# EAGLE design Barebones (EAGLE 9.2.0)
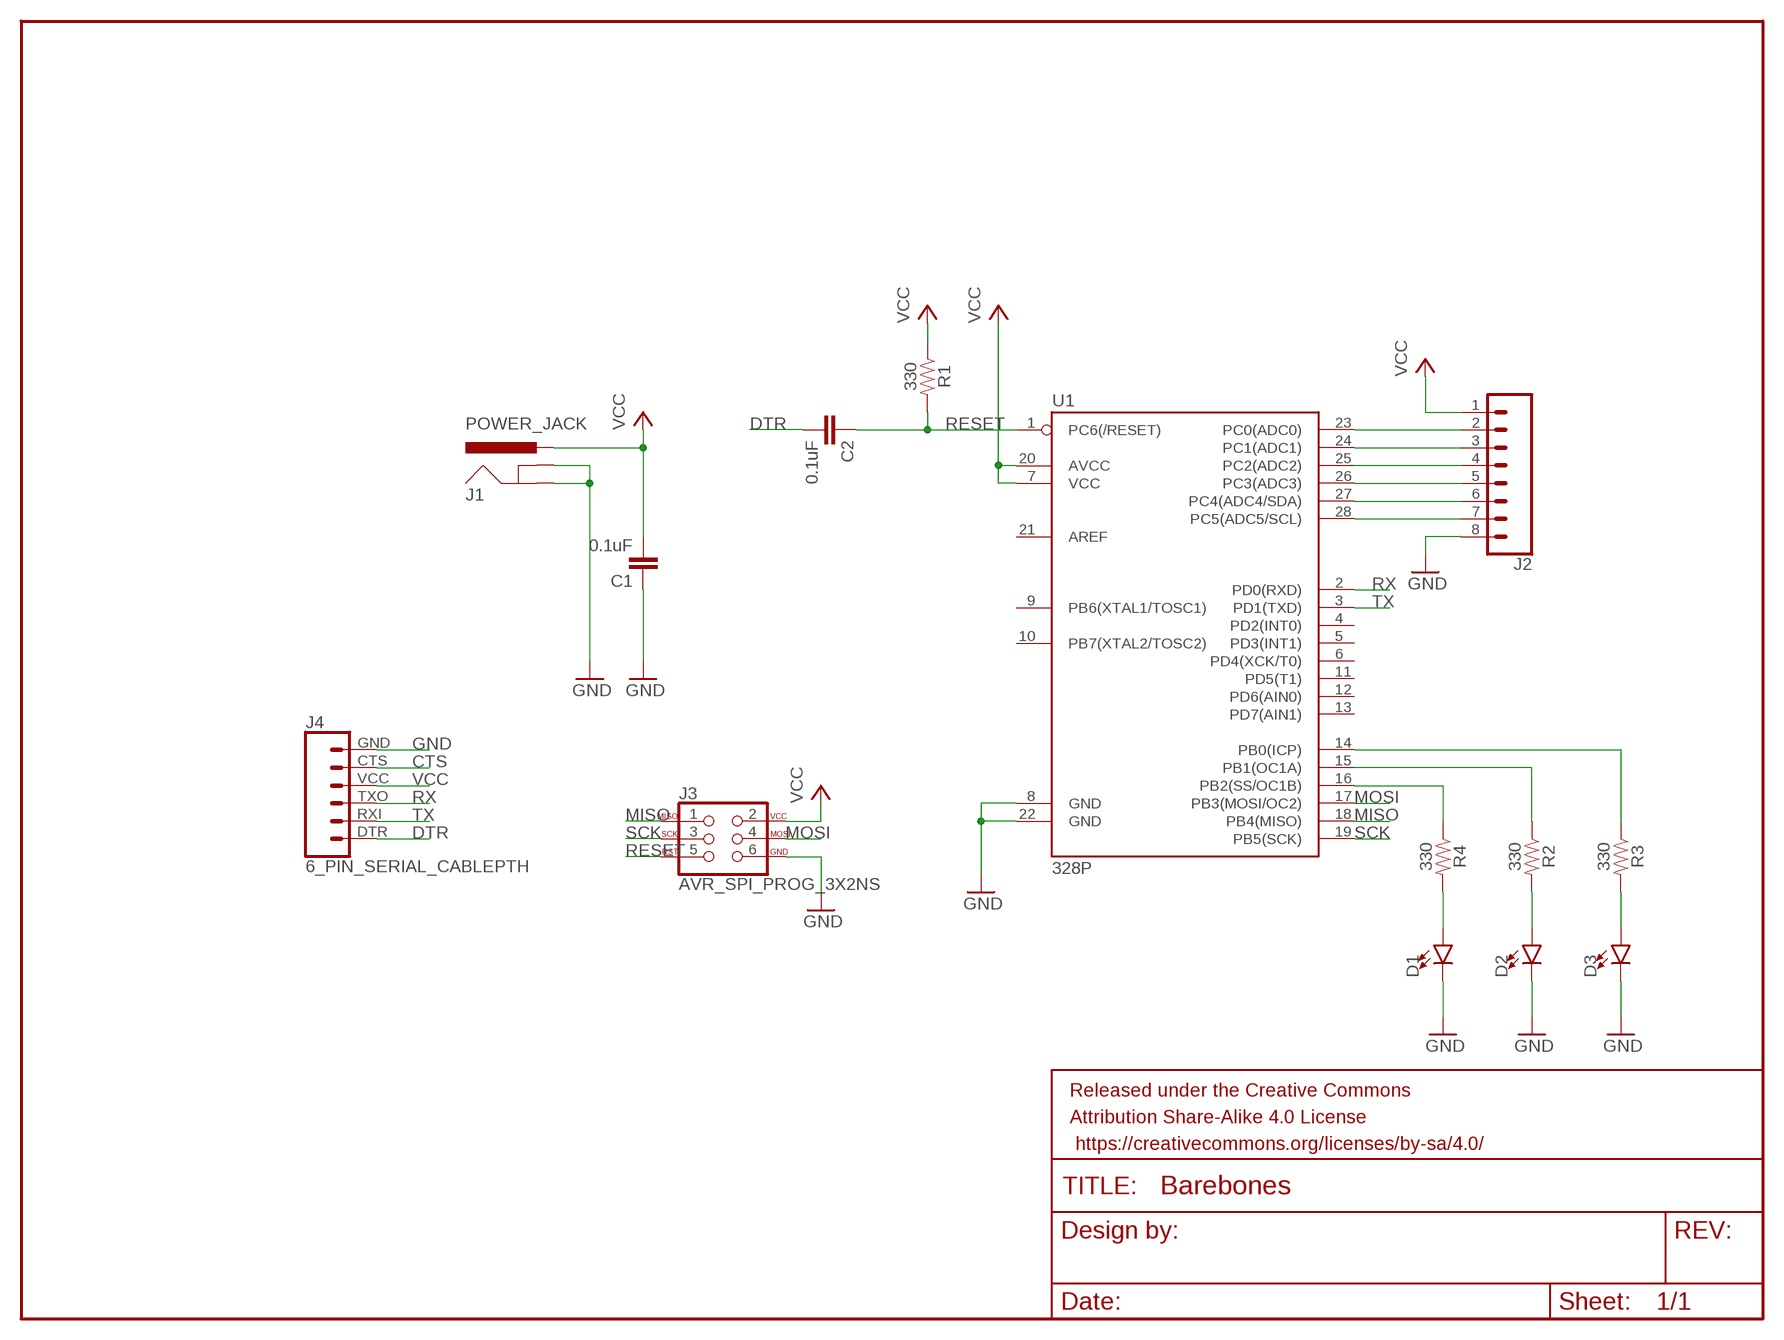
[diagram p0: schematic, sheet 1]

## Parts
C1  0.1uF  0.1UF-KIT-EZ-50V-20%  [CAP-PTH-SMALL-KIT]
C2  0.1uF  0.1UF-KIT-EZ-50V-20%  [CAP-PTH-SMALL-KIT]
D1  LED5MM  [LED_5MM]
D2  LED5MM  [LED_5MM]
D3  LED5MM  [LED_5MM]
FRAME1  FRAME-LETTER  [CREATIVE_COMMONS]
J1  POWER_JACK  [POWER_JACK_PTH]
J2  CONN_08"  [1X08]
J3  AVR_SPI_PROG_3X2NS  [2X3-NS]
J4  6_PIN_SERIAL_CABLEPTH  [FTDI_BASIC]
R1  330  330OHM-HORIZ-1/10W-5%  [AXIAL-0.3]
R2  330  330OHM-HORIZ-1/10W-5%  [AXIAL-0.3]
R3  330  330OHM-HORIZ-1/10W-5%  [AXIAL-0.3]
R4  330  330OHM-HORIZ-1/10W-5%  [AXIAL-0.3]
U1  328P  ATMEGA328P_PDIP  [DIP28]

## Nets
CTS: J4.CTS
DTR: C2.2 J4.DTR
GND: C1.1 D1.K(C) D2.K(C) D3.K(C) J1.GND J1.GNDBREAK J2.8 J3.6 J4.GND U1.8(GND) U1.22(GND)
MISO: J3.1 U1.18(PB4(MISO))
MOSI: J3.4 U1.17(PB3(MOSI/OC2))
N$1: R3.P$1 U1.14(PB0(ICP))
N$2: J2.2 U1.23(PC0(ADC0))
N$3: J2.3 U1.24(PC1(ADC1))
N$4: J2.4 U1.25(PC2(ADC2))
N$5: J2.5 U1.26(PC3(ADC3))
N$6: J2.6 U1.27(PC4(ADC4/SDA))
N$7: R2.P$1 U1.15(PB1(OC1A))
N$8: J2.7 U1.28(PC5(ADC5/SCL))
N$9: R4.P$1 U1.16(PB2(SS/OC1B))
N$11: D1.A R4.P$2
N$12: D2.A R2.P$2
N$13: D3.A R3.P$2
RESET: C2.1 J3.5 R1.P$2 U1.1(PC6(/RESET))
RX: J4.TXO U1.2(PD0(RXD))
SCK: J3.3 U1.19(PB5(SCK))
TX: J4.RXI U1.3(PD1(TXD))
VCC: C1.2 J1.PWR J2.1 J3.2 J4.VCC R1.P$1 U1.7(VCC) U1.20(AVCC)
Unconnected: U1.4(PD2(INT0)) U1.5(PD3(INT1)) U1.6(PD4(XCK/T0)) U1.9(PB6(XTAL1/TOSC1)) U1.10(PB7(XTAL2/TOSC2)) U1.11(PD5(T1)) U1.12(PD6(AIN0)) U1.13(PD7(AIN1)) U1.21(AREF)

## Library data of the parts
C1 C2 = SparkFun-Capacitors:0.1UF: 0.1µF ceramic capacitors A capacitor is a passive two-terminal electrical component used to store electrical energy temporarily in an electric field.; PROD_ID: CAP-08370
D1-D3 = SparkFun-LED:LED: LED (Generic) Standard schematic elements and footprints for 5mm, 3mm, 1206, and 0603 sized LEDs. Generic LEDs with no color specified.
FRAME1 = SparkFun-Aesthetics:FRAME-LETTER: Schematic Frame - Letter Standard 8.5x11 US Letter frame
J1 = SparkFun-Connectors:POWER_JACK: Power Jack Connector This is the standard 5.5mm barrel jack for power. The PTH is the most common, proven, reliable, footprint. The Slot footprint only works if the mill layer is transmitted to the PCB fab house so be warned. Here are the connectors we sell at SparkFun: DC Barrel Power Jack/Connector <https://www.sparkfun.com/products/119> (PRT-00119) DC Barrel Power Jack/Connector (SMD) <https://www.sparkfun.com/products/12748> (PRT-12748) DC Barrel Jack Adapter - Breadboard Compatible <https://www.sparkfun.com/products/10811> (PRT-10811) It is used on this SparkFun product (and many, many others): SparkFun RedBoard - Programmed with Arduino <https://www.sparkfun.com/products/12757> (DEV-12757) Also, if you need a mating power supply or connector, please check these out: Wall Adapter Power Supply - 9VDC 650mA <https://www.sparkfun.com/products/298> (TOL-00298) DC Barrel Jack Adapter - Male <https://www.sparkfun.com/products/10287> (PRT-10287); PROD_ID: CONN-08197
J2 = SparkFun-Connectors:CONN_08: Multi connection point. Often used as Generic Header-pin footprint for 0.1 inch spaced/style header connections On any of the 0.1 inch spaced packages, you can populate with these: Break Away Headers - Straight <https://www.sparkfun.com/products/116> (PRT-00116) Break Away Male Headers - Right Angle <https://www.sparkfun.com/products/553> (PRT-00553) Female Headers <https://www.sparkfun.com/products/115> (PRT-00115) Break Away Headers - Machine Pin <https://www.sparkfun.com/products/117> (PRT-00117) Break Away Female Headers - Swiss Machine Pin <https://www.sparkfun.com/products/743> (PRT-00743) Arduino Stackable Header - 8 Pin <https://www.sparkfun.com/products/9279> (PRT-09279) For SCREWTERMINALS and SPRING TERMINALS visit here: Screw Terimnals on SparkFun.com <https://www.sparkfun.com/search/results?term=Screw+Terminals> (5mm/3.5mm/2.54mm spacing) This device is also useful as a general connection point to wire up your design to another part of your project. Our various solder wires solder well into these plated through hole pads. Hook-Up Wire - Assortment (Stranded, 22 AWG) <https://www.sparkfun.com/products/11375> (PRT-11375) Hook-Up Wire - Assortment (Solid Core, 22 AWG) <https://www.sparkfun.com/products/11367> (PRT-11367) View the entire wire category on our website here <https://www.sparkfun.com/categories/141> Special notes: Molex polarized connector foot print use with SKU : PRT-08231 with associated crimp pins and housings. 1MM SMD Version SKU: PRT-10208 NOTES ON THE VARIANTS LOCK and LOCK_LONGPADS... This footprint was designed to help hold the alignment of a through-hole component (i.e. 6-pin header) while soldering it into place. You may notice that each hole has been shifted either up or down by 0.005 of an inch from it's more standard position (which is a perfectly straight line). This slight alteration caused the pins (the squares in the middle) to touch the edges of the holes. Because they are alternating, it causes a "brace" to hold the component in place. 0.005 has proven to be the perfect amount of "off-center" position when using our standard breakaway headers. Although looks a little odd when you look at the bare footprint, once you have a header in there, the alteration is very hard to notice. Also,if you push a header all the way into place, it is covered up entirely on the bottom side.; PROD_ID: CONN-08438
J3 = SparkFun-Connectors:AVR_SPI_PROG_3X2: AVR ISP 6 Pin This is the reduced ISP connector for AVR programming. Common on Arduino. This footprint will take up less PCB space and can be used with a 10-pin to 6-pin adapter such as SKU: BOB-08508 **Special note about "TEST_POINT" package. The stop mask is on the top side, so if you want your programming test points to be on the bottom of your board, make sure to place this package on the bottom side of the board. This also ensure that the orientation to program from the bottom side will be correct. SparkFun Products: SparkFun ISP Pogo Adapter <https://www.sparkfun.com/products/11591> - NS Tiny AVR Programmer <https://www.sparkfun.com/products/11801> -PTH
J4 = SparkFun-Connectors:6_PIN_SERIAL_CABLE: 6-pin header connection for use with the "FTDI BASIC" pinout - CABLE SIDE. Also known as "Arduino Serial Program Header". This is used on a design to provide a 6-pin connection point for serial communication usually from a USB cable (D+/D-) to these headers (RX/TX). It also has the remaining pins necessary for programming in the Arduino evironment (DTR, GND, and sometimes VCC). Note, this device has "CABLE" in the name. It is intended to be used on a design that usually lives on the end of your USB cable and prvides the converter chip (FTDI232 or FTDI231x) to commnicate serial RX/TX. The "sister" device, named "TARGET" is inteneded to be used on a design that contains a target micro-controller that you wish to program. You can populate with some of these: Female Headers <https://www.sparkfun.com/products/115> (PRT-00115) For reference (or to suit your programming needs) check out these designs: SparkFun FTDI Basic Breakout - 5V <https://www.sparkfun.com/products/9716> (DEV-09716) SparkFun FTDI Basic Breakout - 3.3V <https://www.sparkfun.com/products/9873> (DEV-09873) SparkFun FTDI SmartBasic <https://www.sparkfun.com/products/12935> (DEV-12935) SparkFun Beefy 3 - FTDI Basic Breakout <https://www.sparkfun.com/products/13746> (DEV-13746)
R1-R4 = SparkFun-Resistors:330OHM: 330Ω resistor A resistor is a passive two-terminal electrical component that implements electrical resistance as a circuit element. Resistors act to reduce current flow, and, at the same time, act to lower voltage levels within circuits. - Wikipedia; PROD_ID: RES-8371
U1 = SparkFun-IC-Microcontroller:ATMEGA328P_PDIP: Atmel 328P Through hole ATMEGA328P uC used in the Arduino 32kb flash, 1k EEPROM, 2k SRAM Datasheet <http://www.sparkfun.com/datasheets/Components/SMD/ATMega328.pdf> SparkFun Products Storefront component: AVR 28 Pin 20MHz 32K 6A/D - ATMega328P <https://www.sparkfun.com/products/9061> (COM-09061) SparkFun Simon Says - Through-Hole Soldering Kit <https://www.sparkfun.com/products/10547> (KIT-10547) SparkFun Learn to Solder - Simon Says <https://www.sparkfun.com/products/13708> (KIT-13708) SparkFun BigTime Watch Kit <https://www.sparkfun.com/products/11734> (KIT-11734) SparkFun ClockIt <https://www.sparkfun.com/products/10930> (KIT-10930) SparkFun Serial Enabled LCD Kit <https://www.sparkfun.com/products/10097> (LCD-10097) SparkFun Simon Tilts - Through Hole Soldering Kit <https://www.sparkfun.com/products/12634> (KIT-12634) SparkFun Frequency Counter Kit <https://www.sparkfun.com/products/10140> (KIT-10140) FabFM Radio Kit <https://www.sparkfun.com/products/11043> (KIT-11043) SparkFun Binary Blaster Kit <https://www.sparkfun.com/products/12037> (KIT-12037) SparkFun Metro-Gnome <https://www.sparkfun.com/products/9236> (KIT-09236) ATmega328 with Arduino Optiboot (Uno) <https://www.sparkfun.com/products/10524> (DEV-10524); PROD_ID: IC-09136

## Board
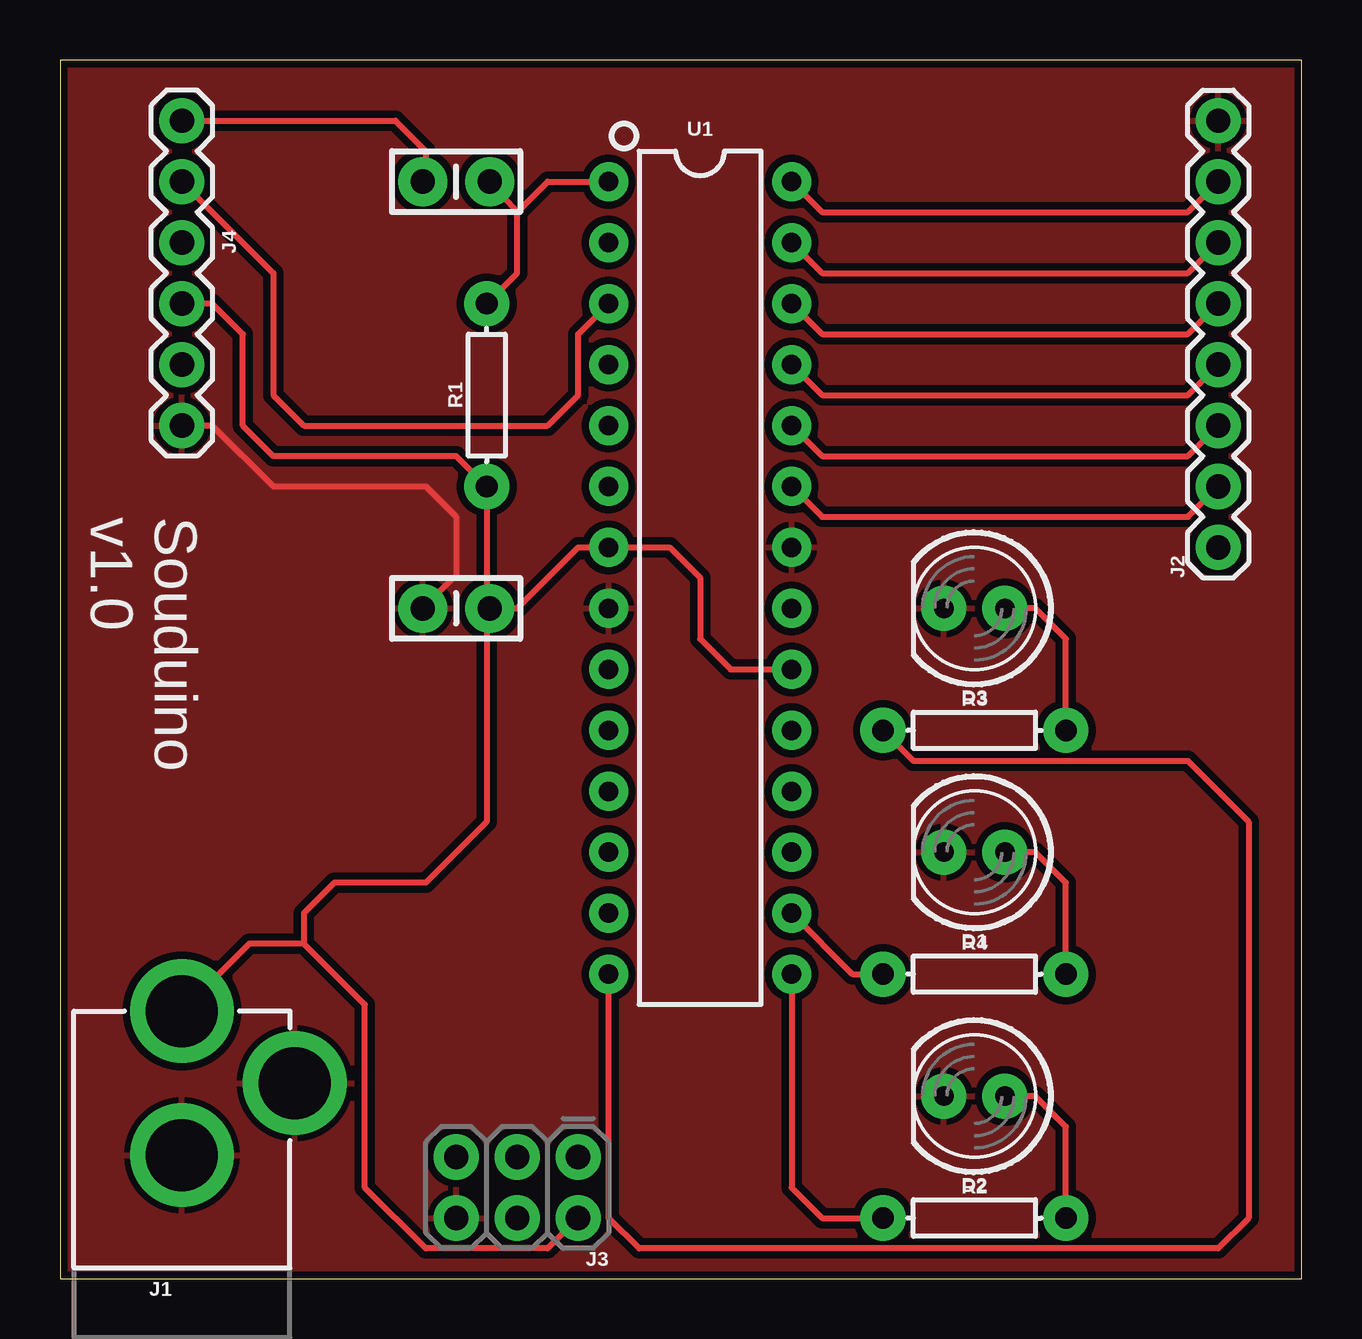
[diagram p1: board, top side]
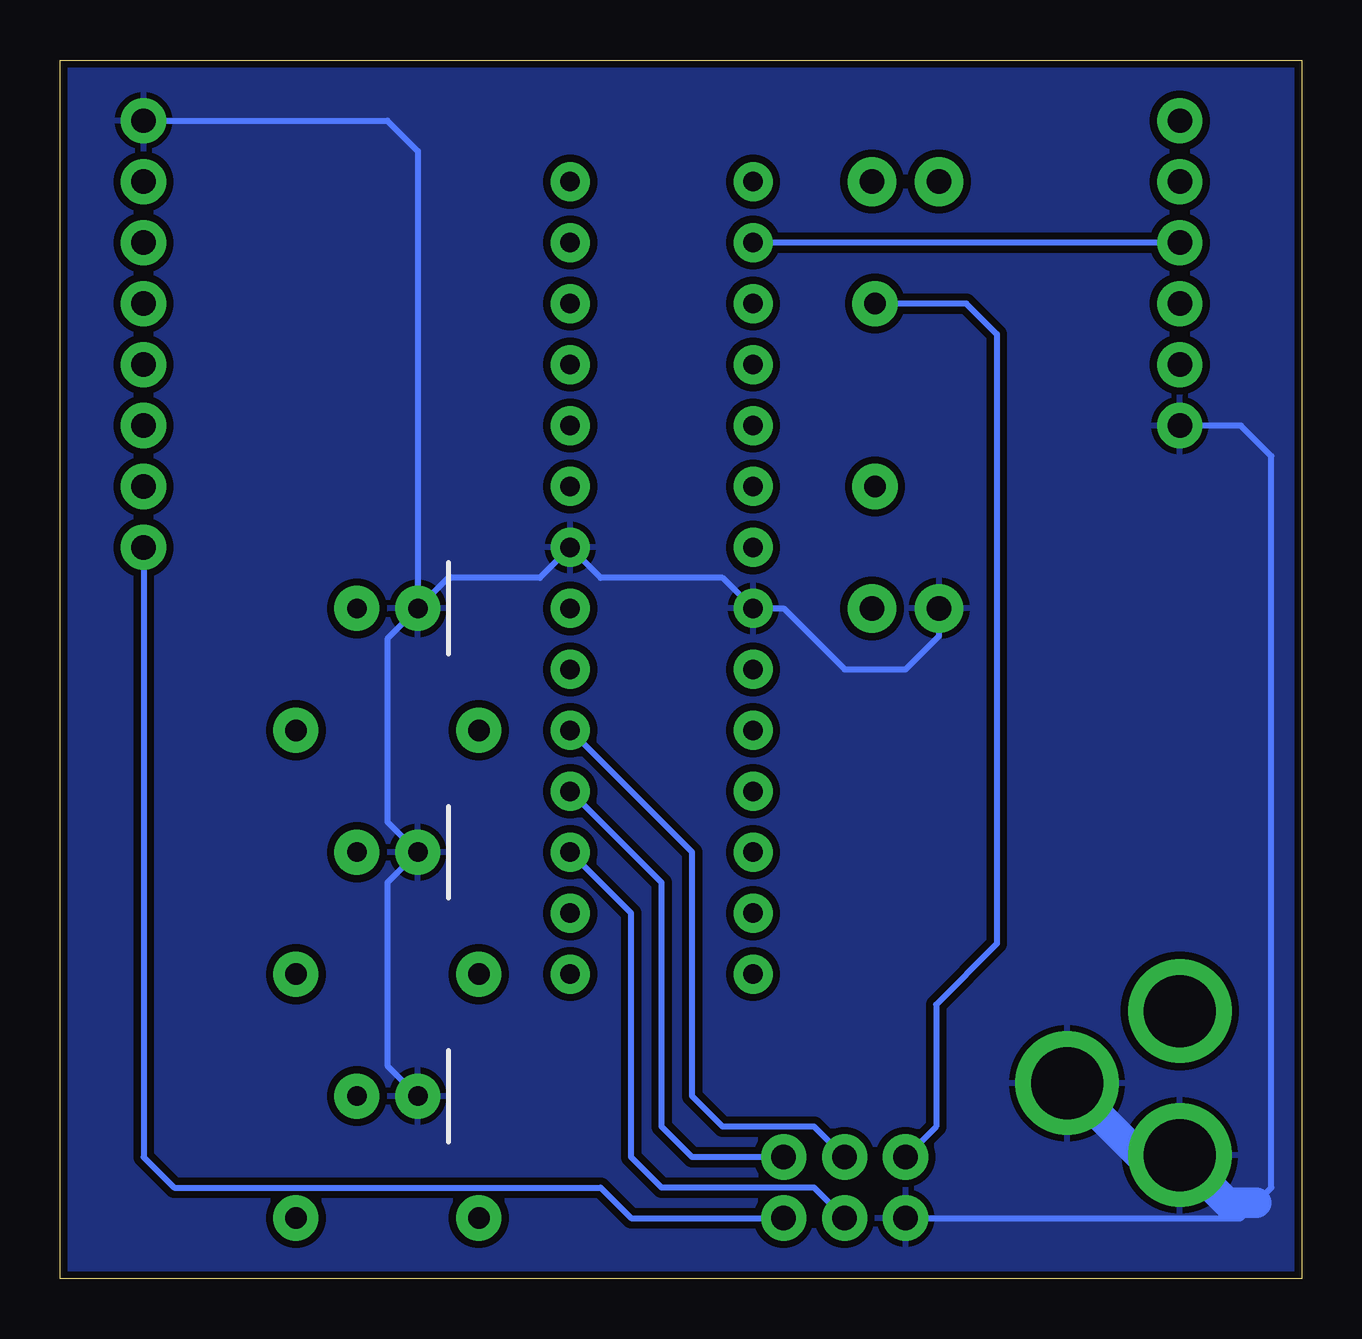
[diagram p2: board, bottom side, seen from below]

Size 51.74 x 50.79 mm. Coordinates in mm from the lower left corner, seen from the top.
Outline: 0,0 51.74,0 51.74,50.79 0,50.79 0,0
Copper layers (1*16): Top 0.035mm / dielectric 1.5mm / Bottom 0.035mm
Design rules "SparkFun": minimum track width 8mil, minimum drill 20mil, track to track 8mil, track to pad 8mil, pad to pad 8mil, via to via 8mil, smd to smd 8mil, copper to edge 8mil, drill to drill 8mil, minimum pad ring 12mil, minimum via ring 10mil, stop-mask expansion 4mil, vias tented up to drill 20mil, thermal gap 10mil

### Footprints (pad centres in the part's own frame; a part is rotated, then mirrored left to right if it is on the bottom)
CAP-PTH-SMALL-KIT = drill 1.016 pad 2.032: 1 -1.397,0; 2 1.397,0
LED_5MM = drill 0.813 pad 1.88: A -1.27,0; K 1.27,0
POWER_JACK_PTH = drill 2.997 pad 4.318: GND 0,7.7; GNDBREAK 4.7,10.7; PWR 0,13.7
1X08 = drill 1.016 pad 1.88: 1 0,0; 2 2.54,0; 3 5.08,0; 4 7.62,0; 5 10.16,0; 6 12.7,0; 7 15.24,0; 8 17.78,0
2X3-NS = drill 1.016 pad 1.88: 1 -2.54,-1.27; 2 -2.54,1.27; 3 0,-1.27; 4 0,1.27; 5 2.54,-1.27; 6 2.54,1.27
FTDI_BASIC = drill 1.016 pad 1.88: CTS 10.16,0; DTR 0,0; GND 12.7,0; RXI 2.54,0; TXO 5.08,0; VCC 7.62,0
AXIAL-0.3 = drill 0.9 pad 1.88: P$1 -3.81,0; P$2 3.81,0
DIP28 = drill 0.813 pad 1.626: 1 -16.51,-3.81; 2 -13.97,-3.81; 3 -11.43,-3.81; 4 -8.89,-3.81; 5 -6.35,-3.81; 6 -3.81,-3.81; 7 -1.27,-3.81; 8 1.27,-3.81; 9 3.81,-3.81; 10 6.35,-3.81; 11 8.89,-3.81; 12 11.43,-3.81; 13 13.97,-3.81; 14 16.51,-3.81; 15 16.51,3.81; 16 13.97,3.81; 17 11.43,3.81; 18 8.89,3.81; 19 6.35,3.81; 20 3.81,3.81; 21 1.27,3.81; 22 -1.27,3.81; 23 -3.81,3.81; 24 -6.35,3.81; 25 -8.89,3.81; 26 -11.43,3.81; 27 -13.97,3.81; 28 -16.51,3.81

### Placement (x,y rotation side)
C1  16.51,27.94 0 top
C2  16.51,45.72 180 top
D1  38.1,17.78 180 top
D2  38.1,7.62 180 top
D3  38.1,27.94 180 top
FRAME1  -128.27,29.21 0 top  (outside the outline)
J1  5.08,-2.54 0 top
J2  48.26,30.48 90 top
J3  19.05,3.81 180 top
J4  5.08,48.26 270 top
R1  17.78,36.83 90 top
R2  38.1,2.54 0 top
R3  38.1,22.86 0 top
R4  38.1,12.7 0 top
U1  26.67,29.21 270 top

### Tracks (layer width: path | path; a pad name or v marks a point on that pad's centre or on a via)
DTR
  Top 0.254: J4.DTR 13.97,48.26 15.24,46.99 15.24,45.85 C2.2
GND
  Top 0.254: C1.1 16.38,29.21 16.51,29.21 16.51,31.75 15.24,33.02 8.89,33.02 6.35,35.56 J4.GND
  Bottom 0.254: C1.1 15.11,26.8 16.51,25.4 19.05,25.4 21.59,27.94 U1.8 24.13,29.21 29.21,29.21 U1.22 31.75,29.21 35.56,29.21 D3.K | J3.6 2.54,2.54 1.91,3.17 1.27,3.81 1.27,34.29 2.54,35.56 J4.GND | J2.8 38.1,48.26 36.83,46.99 D3.K | D3.K 38.1,26.67 38.1,19.05 D1.K 38.1,16.51 38.1,8.89 D2.K
  Bottom 1.27: J1.GNDBREAK 6.78,5.16 J1.GND 3.09,3.17 1.91,3.17
  pour Top (isolate 0.305): 0,0 52.07,0 52.07,50.8 0,50.8
  pour Bottom (isolate 0.305): 0,50.8 52.07,50.8 52.07,0 0,0
MISO
  Bottom 0.254: J3.1 25.4,5.08 26.67,6.35 26.67,16.51 U1.18
MOSI
  Bottom 0.254: J3.4 20.32,3.81 26.67,3.81 27.94,5.08 27.94,15.24 U1.17
N$1
  Top 0.254: R3.P$1 35.56,21.59 46.99,21.59 49.53,19.05 49.53,2.54 48.26,1.27 24.13,1.27 22.86,2.54 U1.14
N$2
  Top 0.254: U1.23 31.75,31.75 46.99,31.75 J2.2
N$3
  Top 0.254: U1.24 31.75,34.29 46.99,34.29 J2.3
N$4
  Top 0.254: U1.25 31.75,36.83 46.99,36.83 J2.4
N$5
  Top 0.254: U1.26 31.75,39.37 46.99,39.37 J2.5
N$6
  Top 0.254: U1.27 31.75,41.91 46.99,41.91 J2.6
N$7
  Top 0.254: U1.15 30.48,3.81 31.75,2.54 R2.P$1
N$8
  Top 0.254: U1.28 31.75,44.45 46.99,44.45 J2.7
N$9
  Top 0.254: R4.P$1 33.02,12.7 U1.16
N$11
  Top 0.254: R4.P$2 41.91,16.51 40.64,17.78 D1.A
N$12
  Top 0.254: R2.P$2 41.91,6.35 40.64,7.62 D2.A
N$13
  Top 0.254: R3.P$2 41.91,26.67 40.64,27.94 D3.A
RESET
  Top 0.254: R1.P$2 19.05,41.91 19.05,44.45 | 19.05,44.45 C2.1 | 19.05,44.45 20.32,45.72 U1.1
  Bottom 0.254: J3.5 15.24,6.35 15.24,11.43 12.7,13.97 12.7,39.37 13.97,40.64 R1.P$2
RX
  Bottom 0.254: J4.TXO U1.2
SCK
  Bottom 0.254: J3.3 20.32,6.35 24.13,6.35 25.4,7.62 25.4,17.78 U1.19
TX
  Top 0.254: J4.RXI 8.89,41.91 8.89,36.83 10.16,35.56 20.32,35.56 21.59,36.83 21.59,39.37 U1.3
VCC
  Top 0.254: J1.PWR 7.89,13.97 10.16,13.97 | C1.2 17.78,28.07 R1.P$1 16.51,34.29 8.89,34.29 7.62,35.56 7.62,39.37 6.35,40.64 J4.VCC | J3.2 20.32,1.27 15.24,1.27 12.7,3.81 12.7,11.43 10.16,13.97 | C1.2 19.05,27.94 21.59,30.48 U1.7 25.4,30.48 26.67,29.21 26.67,26.67 27.94,25.4 U1.20 | C1.2 17.78,27.81 17.78,19.05 15.24,16.51 11.43,16.51 10.16,15.24 10.16,13.97
  Bottom 0.254: J2.1 48.26,5.08 46.99,3.81 29.21,3.81 27.94,2.54 J3.2

### Text on the board
tPlace: Souduino / v1.0